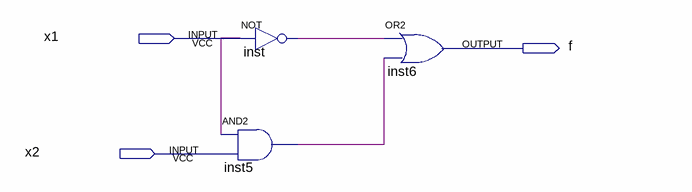
[diagram p0: schematic sheet]
// Quartus schematic Lab01_1.bdf as structural Verilog: 3 symbols, 3 pins
module Lab01_1 (
  input  x1,
  input  x2,
  output f
);

  wire inst5_out, inst_out;

  not inst (inst_out, x1);
  and inst5 (inst5_out, x1, x2);
  or inst6 (f, inst_out, inst5_out);
endmodule
